# EAGLE schematic Raspberry_Pi_Circuit_Board (EAGLE 9.6.2)

## Sheet 1 of 15: Battery Charger
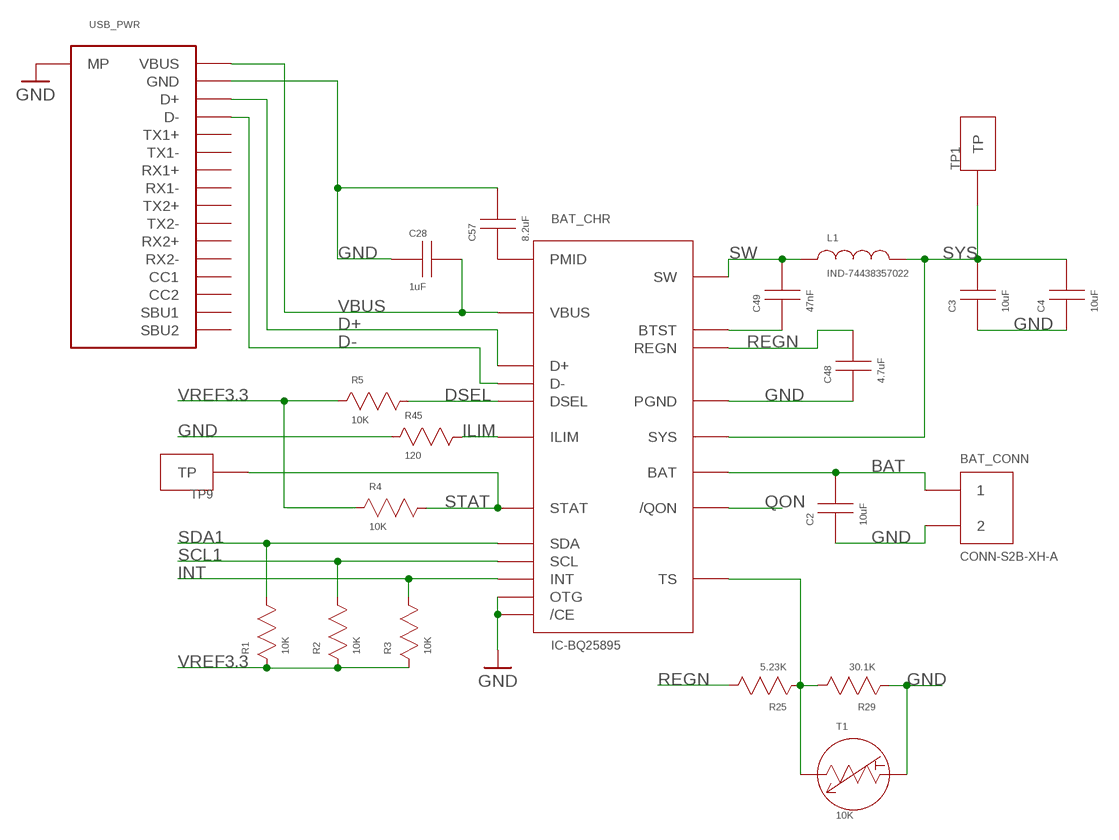
[diagram p0: schematic, sheet 1]

### Parts
BAT_CHR  IC-BQ25895  [IC-BQ25895]
BAT_CONN  CONN-S2B-XH-A  [CONN-S2B-XH-A]
C2  10uF  CAP-603  [CAP-603]
C3  10uF  CAP-603  [CAP-603]
C4  10uF  CAP-603  [CAP-603]
C28  1uF  CAP-603  [CAP-603]
C48  4.7uF  CAP-603  [CAP-603]
C49  47nF  CAP-603  [CAP-603]
C57  8.2uF  CAP-603  [CAP-603]
L1  IND-74438357022  [IND-74438357022]
R1  10K  RES-603  [RES-603]
R2  10K  RES-603  [RES-603]
R3  10K  RES-603  [RES-603]
R4  10K  RES-603  [RES-603]
R5  10K  RES-603  [RES-603]
R25  5.23K  RES-603  [RES-603]
R29  30.1K  RES-603  [RES-603]
R45  120  RES-603  [RES-603]
T1  10K  THERM-NTCLE101E3C90173  [THERM-NTCLE101E3C90173]
TP1  TESTPOINT  [TESTPOINT]
TP9  TESTPOINT  [TESTPOINT]
USB_PWR  USBC-USB-C31-S-RA-CS1D-BK-T/R  [USBC-USB-C31-S-RA-CS1D-BK-T/R]

### Nets
BAT: BAT_CHR.BAT1(BAT) BAT_CHR.BAT2(BAT) BAT_CONN.1 C2.C ; also sheet 8
D+: BAT_CHR.D+ USB_PWR.D+ USB_PWR.D+_2(D+)
D-: BAT_CHR.D- USB_PWR.D- USB_PWR.D-_2(D-)
DSEL: BAT_CHR.DSEL R5.C
GND: BAT_CHR./CE BAT_CHR.OTG BAT_CHR.PGND1(PGND) BAT_CHR.PGND2(PGND) BAT_CHR.PWRPAD(PGND) BAT_CONN.2 C2.A C3.A C4.A C28.A C48.A C57.C R29.A R45.A T1.2 USB_PWR.GND_1(GND) USB_PWR.GND_2(GND) USB_PWR.GND_3(GND) USB_PWR.GND_4(GND) USB_PWR.MP_1(MP) USB_PWR.MP_2(MP) USB_PWR.MP_3(MP) USB_PWR.MP_4(MP) ; also sheet 2,3,4,5,6,7,8,9,10,11,12,13,14,15
ILIM: BAT_CHR.ILIM R45.C
INT: BAT_CHR.INT R3.C
N$1: BAT_CHR.BTST C49.A
N$4: BAT_CHR.TS R25.A R29.C T1.1
N$11: BAT_CHR.PMID C57.A
QON: BAT_CHR./QON ; also sheet 8
REGN: BAT_CHR.REGN C48.C R25.C
SCL1: BAT_CHR.SCL R2.C ; also sheet 9,14
SDA1: BAT_CHR.SDA R1.C ; also sheet 9,14
STAT [PWR 1A]: BAT_CHR.STAT R4.C TP9.TP ; also sheet 8
SW: BAT_CHR.SW1(SW) BAT_CHR.SW2(SW) C49.C L1.A
SYS: BAT_CHR.SYS1(SYS) BAT_CHR.SYS2(SYS) C3.C C4.C L1.C TP1.TP ; also sheet 2,3
VBUS [PWR 1A]: BAT_CHR.VBUS C28.C USB_PWR.VBUS_1(VBUS) USB_PWR.VBUS_2(VBUS) USB_PWR.VBUS_3(VBUS) USB_PWR.VBUS_4(VBUS)
VREF3.3: R1.A R2.A R3.A R4.A R5.A ; also sheet 3,4,5,8,10,11,12,13,14,15
Unconnected: USB_PWR.CC1 USB_PWR.CC2 USB_PWR.RX1+ USB_PWR.RX1- USB_PWR.RX2+ USB_PWR.RX2- USB_PWR.SBU1 USB_PWR.SBU2 USB_PWR.TX1+ USB_PWR.TX1- USB_PWR.TX2+ USB_PWR.TX2-

## Sheet 2 of 15: 5V Regulator
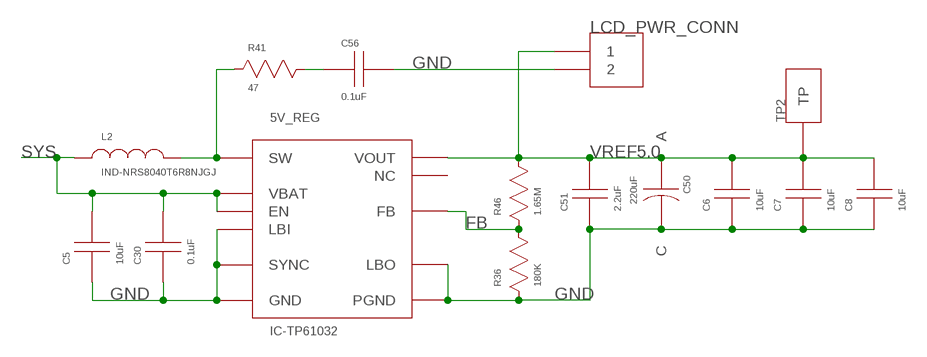
[diagram p1: schematic, sheet 2]

### Parts
5V_REG  IC-TP61032  [IC-TPS61032]
C5  10uF  CAP-603  [CAP-603]
C6  10uF  CAP-603  [CAP-603]
C7  10uF  CAP-603  [CAP-603]
C8  10uF  CAP-603  [CAP-603]
C30  0.1uF  CAP-603  [CAP-603]
C50  220uF  CAP-TAN-1411  [CAP-TAN-1411]
C51  2.2uF  CAP-603  [CAP-603]
C56  0.1uF  CAP-603  [CAP-603]
L2  IND-NRS8040T6R8NJGJ  [IND-NRS8040T6R8NJGJ]
LCD_PWR_CONN  CONN-282834-2  [CONN-282834-2]
R36  180K  RES-603  [RES-603]
R41  47  RES-603  [RES-603]
R46  1.65M  RES-603  [RES-603]
TP2  TESTPOINT  [TESTPOINT]

### Nets
FB: 5V_REG.FB R36.C R46.A
GND: 5V_REG.GND 5V_REG.LBI 5V_REG.LBO 5V_REG.PGND1(PGND) 5V_REG.PGND2(PGND) 5V_REG.PGND3(PGND) 5V_REG.PWRPAD(PGND) 5V_REG.SYNC C5.A C6.A C7.A C8.A C30.A C50.C C51.A C56.C LCD_PWR_CONN.2 R36.A ; also sheet 1,3,4,5,6,7,8,9,10,11,12,13,14,15
N$6: C56.A R41.C
SNUB: 5V_REG.SW1(SW) 5V_REG.SW2(SW) L2.C R41.A
SYS: 5V_REG.EN 5V_REG.VBAT C5.C C30.C L2.A ; also sheet 1,3
VREF5.0: 5V_REG.VOUT1(VOUT) 5V_REG.VOUT2(VOUT) 5V_REG.VOUT3(VOUT) C6.C C7.C C8.C C50.A C51.C LCD_PWR_CONN.1 R46.C TP2.TP ; also sheet 7,8,9,12
Unconnected: 5V_REG.NC

## Sheet 3 of 15: 3.3V/1.8V Regulator
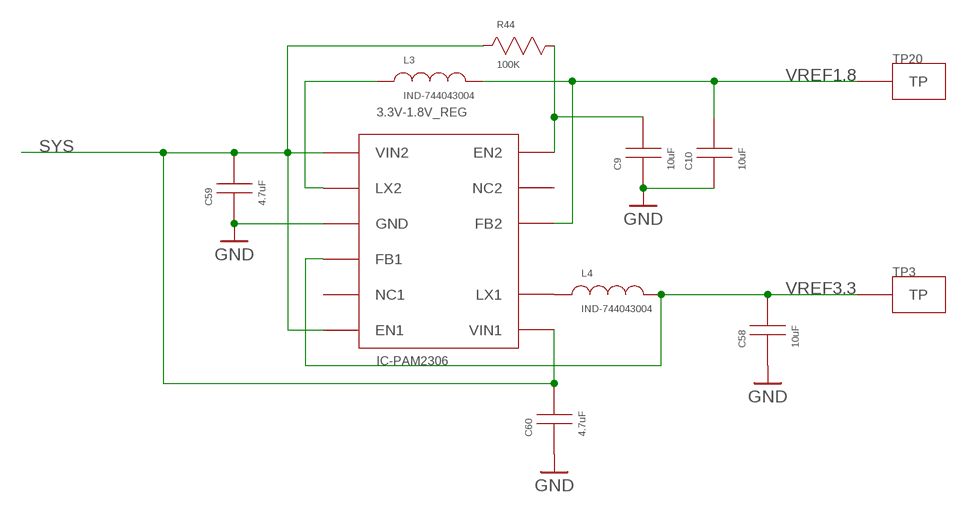
[diagram p2: schematic, sheet 3]

### Parts
3.3V-1.8V_REG  IC-PAM2306  [IC-PAM2306]
C9  10uF  CAP-603  [CAP-603]
C10  10uF  CAP-603  [CAP-603]
C58  10uF  CAP-603  [CAP-603]
C59  4.7uF  CAP-603  [CAP-603]
C60  4.7uF  CAP-603  [CAP-603]
L3  IND-744043004  [IND-744043004]
L4  IND-744043004  [IND-744043004]
R44  100K  RES-603  [RES-603]
TP3  TESTPOINT  [TESTPOINT]
TP20  TESTPOINT  [TESTPOINT]

### Nets
GND: 3.3V-1.8V_REG.GND1(GND) 3.3V-1.8V_REG.GND2(GND) 3.3V-1.8V_REG.PWRPAD(GND) C9.A C10.A C58.A C59.A C60.A ; also sheet 1,2,4,5,6,7,8,9,10,11,12,13,14,15
N$63: 3.3V-1.8V_REG.LX2 L3.A
N$66: 3.3V-1.8V_REG.EN2 C9.C R44.C
N$68: 3.3V-1.8V_REG.LX1 L4.A
SYS: 3.3V-1.8V_REG.EN1 3.3V-1.8V_REG.VIN1 3.3V-1.8V_REG.VIN2 C59.C C60.C R44.A ; also sheet 1,2
VREF1.8: 3.3V-1.8V_REG.FB2 C10.C L3.C TP20.TP ; also sheet 5,15
VREF3.3: 3.3V-1.8V_REG.FB1 C58.C L4.C TP3.TP ; also sheet 1,4,5,8,10,11,12,13,14,15
Unconnected: 3.3V-1.8V_REG.NC1 3.3V-1.8V_REG.NC2

## Sheet 4 of 15: Controller
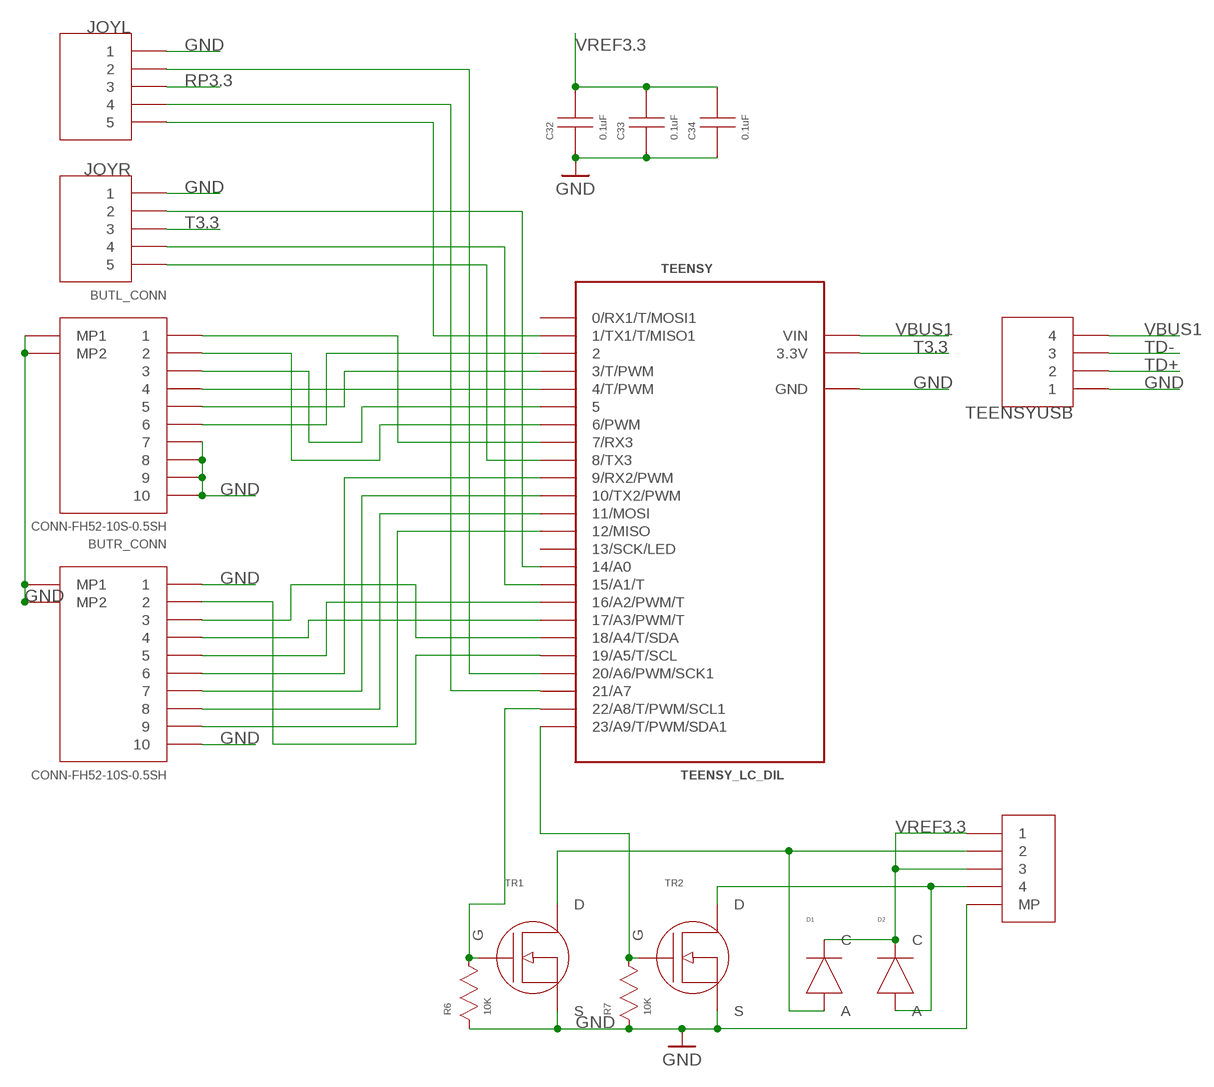
[diagram p3: schematic, sheet 4]

### Parts
BUTL_CONN  CONN-FH52-10S-0.5SH  [CONN-FH52-10S-0.5SH]
BUTR_CONN  CONN-FH52-10S-0.5SH  [CONN-FH52-10S-0.5SH]
C32  0.1uF  CAP-603  [CAP-603]
C33  0.1uF  CAP-603  [CAP-603]
C34  0.1uF  CAP-603  [CAP-603]
D1  DIODE-X3-WLB1608-2  [DIODE-X3-WLB1608-2]
D2  DIODE-X3-WLB1608-2  [DIODE-X3-WLB1608-2]
JOYL  CONN_5PIN  [CONN_5PIN]
JOYR  CONN_5PIN  [CONN_5PIN]
MOT_CONN  CONN-VS4B-ZR-SM4A-TF  [CONN-VS4B-ZR-SM4A-TF]
R6  10K  RES-603  [RES-603]
R7  10K  RES-603  [RES-603]
TEENSY  TEENSY_LC_DIL  [TEENSY_3.0-3.2&LC_DIL]
TEENSYUSB  CONN_4PIN  [CONN_4PIN]
TR1  TRAN-DMG2302UKQ  [TRAN-DMG2302UKQ]
TR2  TRAN-DMG2302UKQ  [TRAN-DMG2302UKQ]

### Nets
GND: BUTL_CONN.7 BUTL_CONN.8 BUTL_CONN.9 BUTL_CONN.10 BUTL_CONN.MP1 BUTL_CONN.MP2 BUTR_CONN.1 BUTR_CONN.10 BUTR_CONN.MP1 BUTR_CONN.MP2 C32.A C33.A C34.A JOYL.1 JOYR.1 MOT_CONN.MP_1(MP) MOT_CONN.MP_2(MP) R6.A R7.A TEENSY.AGND(GND) TEENSY.GND TEENSYUSB.1 TR1.S TR2.S ; also sheet 1,2,3,5,6,7,8,9,10,11,12,13,14,15
N$21: JOYR.2 TEENSY.14/A0
N$22: JOYR.4 TEENSY.15/A1(15/A1/T)
N$23: R6.C TEENSY.22/A8(22/A8/T/PWM/SCL1) TR1.G
N$24: R7.C TEENSY.23/A9(23/A9/T/PWM/SDA1) TR2.G
N$28: BUTR_CONN.8 TEENSY.11(11/MOSI)
N$29: D2.A MOT_CONN.4 TR2.D
N$30: D1.A MOT_CONN.2 TR1.D
N$31: BUTR_CONN.9 TEENSY.12(12/MISO)
N$32: BUTR_CONN.7 TEENSY.10(10/TX2/PWM)
N$33: BUTR_CONN.6 TEENSY.9(9/RX2/PWM)
N$34: JOYR.5 TEENSY.8(8/TX3)
N$35: BUTR_CONN.5 TEENSY.16/A2(16/A2/PWM/T)
N$36: BUTR_CONN.4 TEENSY.17/A3(17/A3/PWM/T)
N$37: BUTR_CONN.3 TEENSY.18/A4(18/A4/T/SDA)
N$38: BUTR_CONN.2 TEENSY.19/A5(19/A5/T/SCL)
N$39: JOYL.2 TEENSY.20/A6(20/A6/PWM/SCK1)
N$40: JOYL.4 TEENSY.21/A7
N$41: JOYL.5 TEENSY.1(1/TX1/T/MISO1)
N$42: BUTL_CONN.6 TEENSY.2
N$43: BUTL_CONN.5 TEENSY.3(3/T/PWM)
N$44: BUTL_CONN.4 TEENSY.4(4/T/PWM)
N$45: BUTL_CONN.3 TEENSY.5
N$46: BUTL_CONN.2 TEENSY.6(6/PWM)
N$47: BUTL_CONN.1 TEENSY.7(7/RX3)
RP3.3: JOYL.3 ; also sheet 6,9
T3.3: JOYR.3 TEENSY.3.3V
TD+: TEENSYUSB.2 ; also sheet 12
TD-: TEENSYUSB.3 ; also sheet 12
VBUS1: TEENSY.VIN TEENSYUSB.4 ; also sheet 11,12
VREF3.3: C32.C C33.C C34.C D1.C D2.C MOT_CONN.1 MOT_CONN.3 ; also sheet 1,3,5,8,10,11,12,13,14,15
Unconnected: TEENSY.0(0/RX1/T/MOSI1) TEENSY.13(13/SCK/LED)

## Sheet 5 of 15: Audio
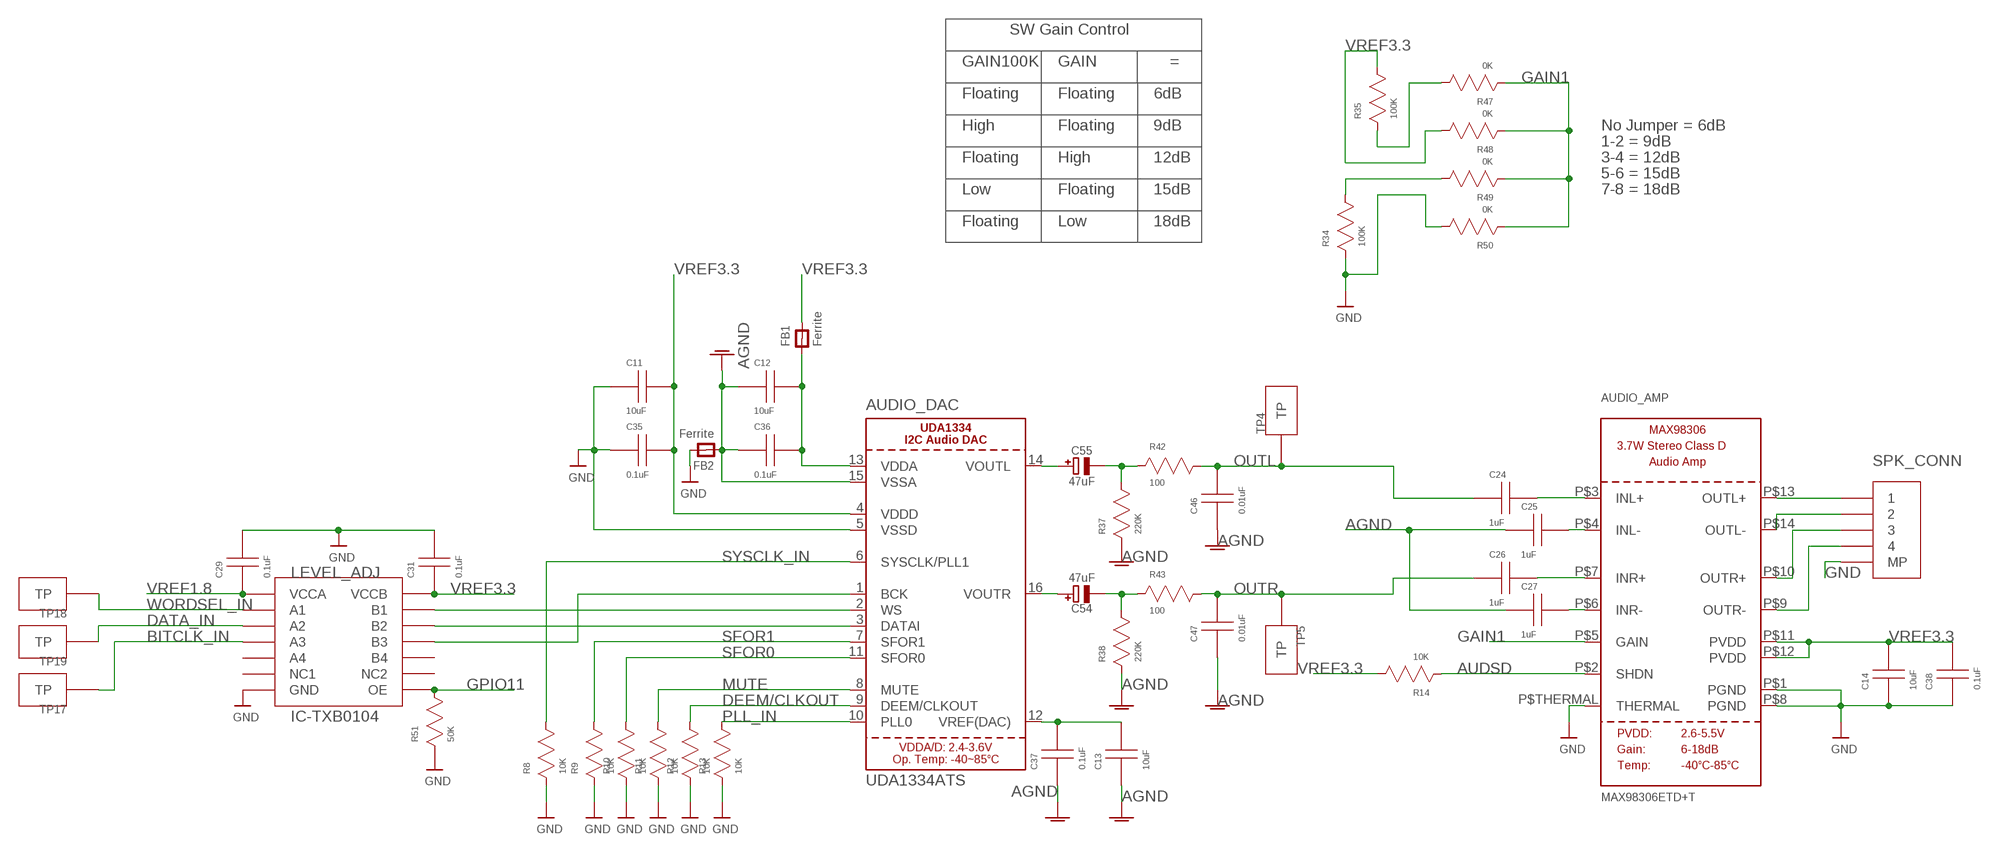
[diagram p4: schematic, sheet 5]

### Parts
AUDIO_AMP  MAX98306ETD+T  AUDIOAMP_MAX98306  [TDFN14_3X3MM]
AUDIO_DAC  UDA1334ATS  AUDIO_I2S_UDA1334""  [SSOP16_4.4MM]
C11  10uF  CAP-603  [CAP-603]
C12  10uF  CAP-603  [CAP-603]
C13  10uF  CAP-603  [CAP-603]
C14  10uF  CAP-603  [CAP-603]
C24  1uF  CAP-603  [CAP-603]
C25  1uF  CAP-603  [CAP-603]
C26  1uF  CAP-603  [CAP-603]
C27  1uF  CAP-603  [CAP-603]
C29  0.1uF  CAP-603  [CAP-603]
C31  0.1uF  CAP-603  [CAP-603]
C35  0.1uF  CAP-603  [CAP-603]
C36  0.1uF  CAP-603  [CAP-603]
C37  0.1uF  CAP-603  [CAP-603]
C38  0.1uF  CAP-603  [CAP-603]
C46  0.01uF  CAP-603  [CAP-603]
C47  0.01uF  CAP-603  [CAP-603]
C54  47uF  CAP_ELECTROLYTICPANASONIC_C  [PANASONIC_C]
C55  47uF  CAP_ELECTROLYTICPANASONIC_C  [PANASONIC_C]
FB1  Ferrite  FERRITE0805  [0805@1]
FB2  Ferrite  FERRITE0805  [0805@1]
LEVEL_ADJ  IC-TXB0104  [IC-TXB0104]
R8  10K  RES-603  [RES-603]
R9  10K  RES-603  [RES-603]
R10  10K  RES-603  [RES-603]
R11  10K  RES-603  [RES-603]
R12  10K  RES-603  [RES-603]
R13  10K  RES-603  [RES-603]
R14  10K  RES-603  [RES-603]
R34  100K  RES-603  [RES-603]
R35  100K  RES-603  [RES-603]
R37  220K  RES-603  [RES-603]
R38  220K  RES-603  [RES-603]
R42  100  RES-603  [RES-603]
R43  100  RES-603  [RES-603]
R47  0K  RES-603  [RES-603]
R48  0K  RES-603  [RES-603]
R49  0K  RES-603  [RES-603]
R50  0K  RES-603  [RES-603]
R51  50K  RES-603  [RES-603]
SPK_CONN  CONN-VS4B-ZR-SM4A-TF  [CONN-VS4B-ZR-SM4A-TF]
TP4  TESTPOINT  [TESTPOINT]
TP5  TESTPOINT  [TESTPOINT]
TP17  TESTPOINT  [TESTPOINT]
TP18  TESTPOINT  [TESTPOINT]
TP19  TESTPOINT  [TESTPOINT]

### Nets
AGND: AUDIO_DAC.15(VSSA) C12.A C13.A C25.A C27.A C36.A C37.A C46.A C47.A FB2.1 R37.A R38.A ; also sheet 11
AUDSD: AUDIO_AMP.P$2(SHDN) R14.A ; also sheet 11
BITCLK_IN: LEVEL_ADJ.A3 TP17.TP ; also sheet 9
DATA_IN: LEVEL_ADJ.A2 TP19.TP ; also sheet 9
DEEM/CLKOUT: AUDIO_DAC.9(DEEM/CLKOUT) R12.C
GAIN1: AUDIO_AMP.P$5(GAIN) R47.A R48.A R49.A R50.A
GND: AUDIO_AMP.P$1(PGND) AUDIO_AMP.P$8(PGND) AUDIO_AMP.P$THERMAL(THERMAL) AUDIO_DAC.5(VSSD) C11.A C14.A C29.C C31.C C35.A C38.A FB2.2 LEVEL_ADJ.GND R8.A R9.A R10.A R11.A R12.A R13.A R34.A R50.C R51.A SPK_CONN.MP_1(MP) SPK_CONN.MP_2(MP) ; also sheet 1,2,3,4,6,7,8,9,10,11,12,13,14,15
GPIO11: LEVEL_ADJ.OE R51.C ; also sheet 9
MUTE: AUDIO_DAC.8(MUTE) R11.C
N$3: AUDIO_DAC.13(VDDA) C12.C C36.C FB1.1
N$5: C54.- R38.C R43.A
N$7: C55.- R37.C R42.A
N$8: AUDIO_DAC.1(BCK) LEVEL_ADJ.B3
N$9: AUDIO_DAC.2(WS) LEVEL_ADJ.B1
N$10: AUDIO_DAC.12(VREF(DAC)) C13.C C37.C
N$12: AUDIO_DAC.16(VOUTR) C54.+
N$13: AUDIO_DAC.14(VOUTL) C55.+
N$14: R35.A R47.C
N$15: R34.C R49.C
N$16: AUDIO_AMP.P$3(INL+) C24.C
N$17: AUDIO_AMP.P$4(INL-) C25.C
N$18: AUDIO_AMP.P$7(INR+) C26.C
N$19: AUDIO_AMP.P$6(INR-) C27.C
N$20: AUDIO_AMP.P$13(OUTL+) SPK_CONN.1
N$25: AUDIO_AMP.P$14(OUTL-) SPK_CONN.2
N$26: AUDIO_AMP.P$10(OUTR+) SPK_CONN.3
N$27: AUDIO_AMP.P$9(OUTR-) SPK_CONN.4
N$67: AUDIO_DAC.3(DATAI) LEVEL_ADJ.B2
OUTL: C24.A C46.C R42.C TP4.TP ; also sheet 11
OUTR: C26.A C47.C R43.C TP5.TP ; also sheet 11
PLL_IN: AUDIO_DAC.10(PLL0) R13.C
SFOR0: AUDIO_DAC.11(SFOR0) R10.C
SFOR1: AUDIO_DAC.7(SFOR1) R9.C
SYSCLK_IN: AUDIO_DAC.6(SYSCLK/PLL1) R8.C
VREF1.8: C29.A LEVEL_ADJ.VCCA ; also sheet 3,15
VREF3.3: AUDIO_AMP.P$11(PVDD) AUDIO_AMP.P$12(PVDD) AUDIO_DAC.4(VDDD) C11.C C14.C C31.A C35.C C38.C FB1.2 LEVEL_ADJ.VCCB R14.C R35.C R48.C ; also sheet 1,3,4,8,10,11,12,13,14,15
WORDSEL_IN: LEVEL_ADJ.A1 TP18.TP ; also sheet 9
Unconnected: LEVEL_ADJ.A4 LEVEL_ADJ.B4 LEVEL_ADJ.NC1 LEVEL_ADJ.NC2

### Notes on the sheet
- SW Gain Control
- GAIN100K | GAIN | =
- Floating | Floating | 6dB
- High | Floating | 9dB | No Jumper = 6dB
- 1-2 = 9dB
- Floating | High | 12dB | 3-4 = 12dB
- 5-6 = 15dB
- Low | Floating | 15dB | 7-8 = 18dB
- Floating | Low | 18dB

## Sheet 6 of 15: MicroSD
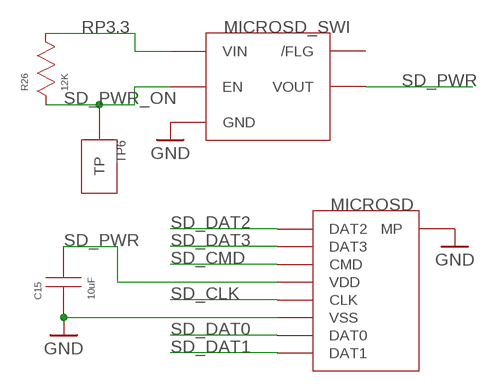
[diagram p5: schematic, sheet 6]

### Parts
C15  10uF  CAP-603  [CAP-603]
MICROSD  MICROSD-5033981892_SD  [MICROSD-5033981892_SD]
MICROSD_SWI  IC-RT9742  [IC-RT9742]
R26  12K  RES-603  [RES-603]
TP6  TESTPOINT  [TESTPOINT]

### Nets
GND: C15.A MICROSD.DL(MP) MICROSD.DS(MP) MICROSD.MP_1(MP) MICROSD.MP_2(MP) MICROSD.MP_3(MP) MICROSD.MP_4(MP) MICROSD.VSS MICROSD_SWI.GND ; also sheet 1,2,3,4,5,7,8,9,10,11,12,13,14,15
RP3.3: MICROSD_SWI.VIN R26.C ; also sheet 4,9
SD_CLK: MICROSD.CLK ; also sheet 9
SD_CMD: MICROSD.CMD ; also sheet 9
SD_DAT0: MICROSD.DAT0 ; also sheet 9
SD_DAT1: MICROSD.DAT1 ; also sheet 9
SD_DAT2: MICROSD.DAT2 ; also sheet 9
SD_DAT3: MICROSD.DAT3 ; also sheet 9
SD_PWR: C15.C MICROSD.VDD MICROSD_SWI.VOUT
SD_PWR_ON: MICROSD_SWI.EN R26.A TP6.TP ; also sheet 9
Unconnected: MICROSD_SWI./FLG

## Sheet 7 of 15: HDMI
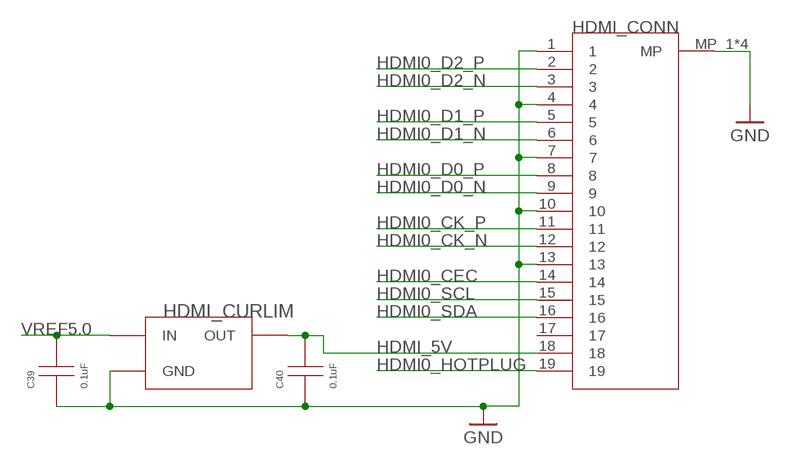
[diagram p6: schematic, sheet 7]

### Parts
C39  0.1uF  CAP-603  [CAP-603]
C40  0.1uF  CAP-603  [CAP-603]
HDMI_CONN  HDMI-2001-1-2-21-00-BK  [HDMI-2001-1-2-21-00-BK]
HDMI_CURLIM  CURLIM-AP2331  [CURLIM-AP2331]

### Nets
GND: C39.A C40.A HDMI_CONN.1 HDMI_CONN.4 HDMI_CONN.7 HDMI_CONN.10 HDMI_CONN.13 HDMI_CONN.MP_1(MP) HDMI_CONN.MP_2(MP) HDMI_CONN.MP_3(MP) HDMI_CONN.MP_4(MP) HDMI_CURLIM.GND ; also sheet 1,2,3,4,5,6,8,9,10,11,12,13,14,15
HDMI0_CEC: HDMI_CONN.14 ; also sheet 9
HDMI0_CK_N: HDMI_CONN.12 ; also sheet 9
HDMI0_CK_P: HDMI_CONN.11 ; also sheet 9
HDMI0_D0_N: HDMI_CONN.9 ; also sheet 9
HDMI0_D0_P: HDMI_CONN.8 ; also sheet 9
HDMI0_D1_N: HDMI_CONN.6 ; also sheet 9
HDMI0_D1_P: HDMI_CONN.5 ; also sheet 9
HDMI0_D2_N: HDMI_CONN.3 ; also sheet 9
HDMI0_D2_P: HDMI_CONN.2 ; also sheet 9
HDMI0_HOTPLUG: HDMI_CONN.19 ; also sheet 9
HDMI0_SCL: HDMI_CONN.15 ; also sheet 9
HDMI0_SDA: HDMI_CONN.16 ; also sheet 9
HDMI_5V: C40.C HDMI_CONN.18 HDMI_CURLIM.OUT
VREF5.0: C39.C HDMI_CURLIM.IN ; also sheet 2,8,9,12
Unconnected: HDMI_CONN.17

## Sheet 8 of 15: Buttons/LEDs
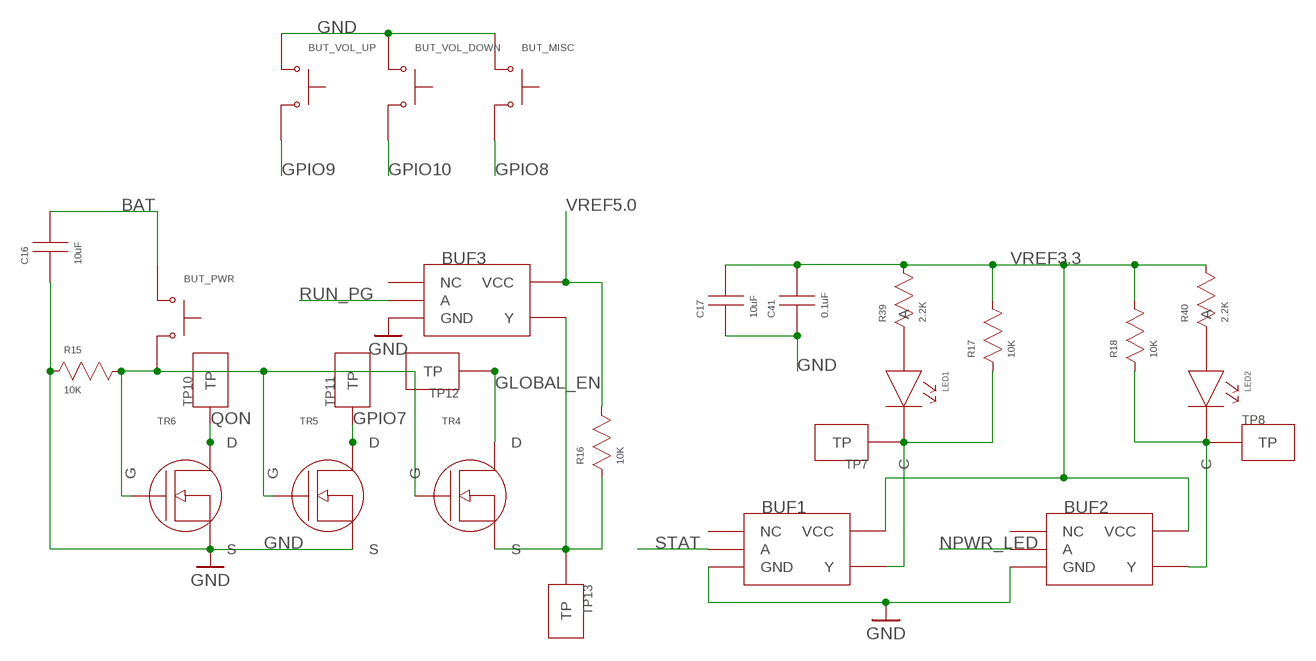
[diagram p7: schematic, sheet 8]

### Parts
BUF1  BUF-74LVC1G07  [BUF-74LVC1G07]
BUF2  BUF-74LVC1G07  [BUF-74LVC1G07]
BUF3  BUF-74LVC1G07  [BUF-74LVC1G07]
BUT_MISC  BUT-KSS331GLFS  [BUT-KSS331GLFS]
BUT_PWR  BUT-KSS331GLFS  [BUT-KSS331GLFS]
BUT_VOL_DOWN  BUT-KSS331GLFS  [BUT-KSS331GLFS]
BUT_VOL_UP  BUT-KSS331GLFS  [BUT-KSS331GLFS]
C16  10uF  CAP-603  [CAP-603]
C17  10uF  CAP-603  [CAP-603]
C41  0.1uF  CAP-603  [CAP-603]
LED1  LED-SM0805UWC  [LED-SM0805UWC]
LED2  LED-SM0805UWC  [LED-SM0805UWC]
R15  10K  RES-603  [RES-603]
R16  10K  RES-603  [RES-603]
R17  10K  RES-603  [RES-603]
R18  10K  RES-603  [RES-603]
R39  2.2K  RES-603  [RES-603]
R40  2.2K  RES-603  [RES-603]
TP7  TESTPOINT  [TESTPOINT]
TP8  TESTPOINT  [TESTPOINT]
TP10  TESTPOINT  [TESTPOINT]
TP11  TESTPOINT  [TESTPOINT]
TP12  TESTPOINT  [TESTPOINT]
TP13  TESTPOINT  [TESTPOINT]
TR4  TRAN-DMG2302UKQ  [TRAN-DMG2302UKQ]
TR5  TRAN-DMG2302UKQ  [TRAN-DMG2302UKQ]
TR6  TRAN-DMG2302UKQ  [TRAN-DMG2302UKQ]

### Nets
BAT: BUT_PWR.1 C16.C ; also sheet 1
GLOBAL_EN: TP12.TP TR4.D ; also sheet 9
GND: BUF1.GND BUF2.GND BUF3.GND BUT_MISC.1 BUT_VOL_DOWN.1 BUT_VOL_UP.1 C16.A C17.A C41.A R15.A TR5.S TR6.S ; also sheet 1,2,3,4,5,6,7,9,10,11,12,13,14,15
GPIO7: TP11.TP TR5.D ; also sheet 9
GPIO8: BUT_MISC.2 ; also sheet 9
GPIO9: BUT_VOL_UP.2 ; also sheet 9
GPIO10: BUT_VOL_DOWN.2 ; also sheet 9
N$2: BUF1.Y LED1.C R17.A TP7.TP
N$48: BUT_PWR.2 R15.C TR4.G TR5.G TR6.G
N$49: LED1.A R39.A
N$50: LED2.A R40.A
N$51: BUF2.Y LED2.C R18.A TP8.TP
N$53: BUF3.Y R16.A TP13.TP TR4.S
NPWR_LED: BUF2.A ; also sheet 9
QON: TP10.TP TR6.D ; also sheet 1
RUN_PG: BUF3.A ; also sheet 9
STAT [PWR 1A]: BUF1.A ; also sheet 1
VREF3.3: BUF1.VCC BUF2.VCC C17.C C41.C R17.C R18.C R39.C R40.C ; also sheet 1,3,4,5,10,11,12,13,14,15
VREF5.0: BUF3.VCC R16.C ; also sheet 2,7,9,12
Unconnected: BUF1.NC BUF2.NC BUF3.NC

## Sheet 9 of 15: Raspberry Pi
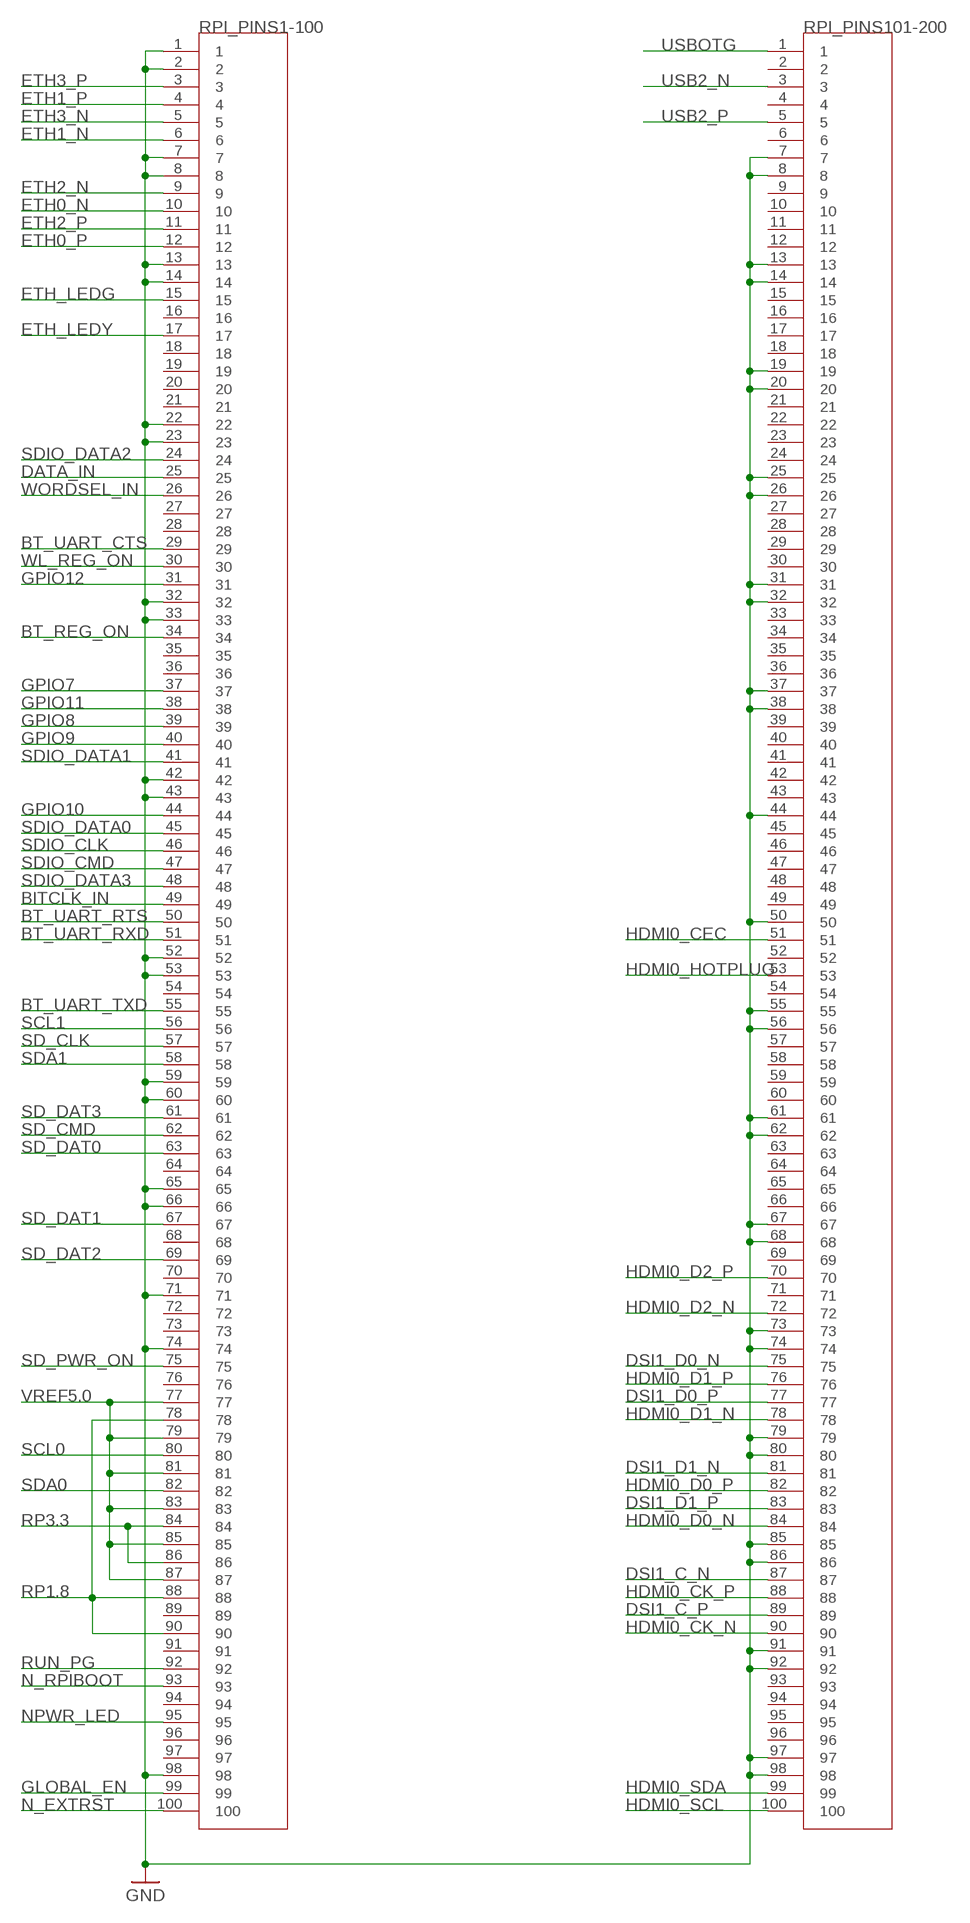
[diagram p8: schematic, sheet 9]

### Parts
RPI_PINS1-100  CONN-DF40_CL0594-5437-8-00_2D  [CONN-DF40_CL0594-5437-8-00_2D]
RPI_PINS101-200  CONN-DF40_CL0594-5437-8-00_2D  [CONN-DF40_CL0594-5437-8-00_2D]

### Nets
BITCLK_IN: RPI_PINS1-100.49 ; also sheet 5
BT_REG_ON: RPI_PINS1-100.34 ; also sheet 15
BT_UART_CTS: RPI_PINS1-100.29 ; also sheet 15
BT_UART_RTS: RPI_PINS1-100.50 ; also sheet 15
BT_UART_RXD: RPI_PINS1-100.51 ; also sheet 15
BT_UART_TXD: RPI_PINS1-100.55 ; also sheet 15
DATA_IN: RPI_PINS1-100.25 ; also sheet 5
DSI1_C_N: RPI_PINS101-200.87 ; also sheet 10
DSI1_C_P: RPI_PINS101-200.89 ; also sheet 10
DSI1_D0_N: RPI_PINS101-200.75 ; also sheet 10
DSI1_D0_P: RPI_PINS101-200.77 ; also sheet 10
DSI1_D1_N: RPI_PINS101-200.81 ; also sheet 10
DSI1_D1_P: RPI_PINS101-200.83 ; also sheet 10
ETH0_N: RPI_PINS1-100.10 ; also sheet 11
ETH0_P: RPI_PINS1-100.12 ; also sheet 11
ETH1_N: RPI_PINS1-100.6 ; also sheet 11
ETH1_P: RPI_PINS1-100.4 ; also sheet 11
ETH2_N: RPI_PINS1-100.9 ; also sheet 11
ETH2_P: RPI_PINS1-100.11 ; also sheet 11
ETH3_N: RPI_PINS1-100.5 ; also sheet 11
ETH3_P: RPI_PINS1-100.3 ; also sheet 11
ETH_LEDG: RPI_PINS1-100.15 ; also sheet 11
ETH_LEDY: RPI_PINS1-100.17 ; also sheet 11
GLOBAL_EN: RPI_PINS1-100.99 ; also sheet 8
GND: RPI_PINS1-100.1 RPI_PINS1-100.2 RPI_PINS1-100.7 RPI_PINS1-100.8 RPI_PINS1-100.13 RPI_PINS1-100.14 RPI_PINS1-100.22 RPI_PINS1-100.23 RPI_PINS1-100.32 RPI_PINS1-100.33 RPI_PINS1-100.42 RPI_PINS1-100.43 RPI_PINS1-100.52 RPI_PINS1-100.53 RPI_PINS1-100.59 RPI_PINS1-100.60 RPI_PINS1-100.65 RPI_PINS1-100.66 RPI_PINS1-100.71 RPI_PINS1-100.74 RPI_PINS1-100.98 RPI_PINS101-200.7 RPI_PINS101-200.8 RPI_PINS101-200.13 RPI_PINS101-200.14 RPI_PINS101-200.19 RPI_PINS101-200.20 RPI_PINS101-200.25 RPI_PINS101-200.26 RPI_PINS101-200.31 RPI_PINS101-200.32 RPI_PINS101-200.37 RPI_PINS101-200.38 RPI_PINS101-200.44 RPI_PINS101-200.50 RPI_PINS101-200.55 RPI_PINS101-200.56 RPI_PINS101-200.61 RPI_PINS101-200.62 RPI_PINS101-200.67 RPI_PINS101-200.68 RPI_PINS101-200.73 RPI_PINS101-200.74 RPI_PINS101-200.79 RPI_PINS101-200.80 RPI_PINS101-200.85 RPI_PINS101-200.86 RPI_PINS101-200.91 RPI_PINS101-200.92 RPI_PINS101-200.97 RPI_PINS101-200.98 ; also sheet 1,2,3,4,5,6,7,8,10,11,12,13,14,15
GPIO7: RPI_PINS1-100.37 ; also sheet 8
GPIO8: RPI_PINS1-100.39 ; also sheet 8
GPIO9: RPI_PINS1-100.40 ; also sheet 8
GPIO10: RPI_PINS1-100.44 ; also sheet 8
GPIO11: RPI_PINS1-100.38 ; also sheet 5
GPIO12: RPI_PINS1-100.31 ; also sheet 13
HDMI0_CEC: RPI_PINS101-200.51 ; also sheet 7
HDMI0_CK_N: RPI_PINS101-200.90 ; also sheet 7
HDMI0_CK_P: RPI_PINS101-200.88 ; also sheet 7
HDMI0_D0_N: RPI_PINS101-200.84 ; also sheet 7
HDMI0_D0_P: RPI_PINS101-200.82 ; also sheet 7
HDMI0_D1_N: RPI_PINS101-200.78 ; also sheet 7
HDMI0_D1_P: RPI_PINS101-200.76 ; also sheet 7
HDMI0_D2_N: RPI_PINS101-200.72 ; also sheet 7
HDMI0_D2_P: RPI_PINS101-200.70 ; also sheet 7
HDMI0_HOTPLUG: RPI_PINS101-200.53 ; also sheet 7
HDMI0_SCL: RPI_PINS101-200.100 ; also sheet 7
HDMI0_SDA: RPI_PINS101-200.99 ; also sheet 7
N_EXTRST: RPI_PINS1-100.100 ; also sheet 12
N_RPIBOOT: RPI_PINS1-100.93 ; also sheet 12
NPWR_LED: RPI_PINS1-100.95 ; also sheet 8
RP1.8: RPI_PINS1-100.78 RPI_PINS1-100.88 RPI_PINS1-100.90
RP3.3: RPI_PINS1-100.84 RPI_PINS1-100.86 ; also sheet 4,6
RUN_PG: RPI_PINS1-100.92 ; also sheet 8
SCL0: RPI_PINS1-100.80 ; also sheet 10
SCL1: RPI_PINS1-100.56 ; also sheet 1,14
SD_CLK: RPI_PINS1-100.57 ; also sheet 6
SD_CMD: RPI_PINS1-100.62 ; also sheet 6
SD_DAT0: RPI_PINS1-100.63 ; also sheet 6
SD_DAT1: RPI_PINS1-100.67 ; also sheet 6
SD_DAT2: RPI_PINS1-100.69 ; also sheet 6
SD_DAT3: RPI_PINS1-100.61 ; also sheet 6
SD_PWR_ON: RPI_PINS1-100.75 ; also sheet 6
SDA0: RPI_PINS1-100.82 ; also sheet 10
SDA1: RPI_PINS1-100.58 ; also sheet 1,14
SDIO_CLK: RPI_PINS1-100.46 ; also sheet 15
SDIO_CMD: RPI_PINS1-100.47 ; also sheet 15
SDIO_DATA0: RPI_PINS1-100.45 ; also sheet 15
SDIO_DATA1: RPI_PINS1-100.41 ; also sheet 15
SDIO_DATA2: RPI_PINS1-100.24 ; also sheet 15
SDIO_DATA3: RPI_PINS1-100.48 ; also sheet 15
USB2_N: RPI_PINS101-200.3 ; also sheet 12
USB2_P: RPI_PINS101-200.5 ; also sheet 12
USBOTG: RPI_PINS101-200.1 ; also sheet 12
VREF5.0: RPI_PINS1-100.77 RPI_PINS1-100.79 RPI_PINS1-100.81 RPI_PINS1-100.83 RPI_PINS1-100.85 RPI_PINS1-100.87 ; also sheet 2,7,8,12
WL_REG_ON: RPI_PINS1-100.30 ; also sheet 15
WORDSEL_IN: RPI_PINS1-100.26 ; also sheet 5
Unconnected: RPI_PINS1-100.16 RPI_PINS1-100.18 RPI_PINS1-100.19 RPI_PINS1-100.20 RPI_PINS1-100.21 RPI_PINS1-100.27 RPI_PINS1-100.28 RPI_PINS1-100.35 RPI_PINS1-100.36 RPI_PINS1-100.54 RPI_PINS1-100.64 RPI_PINS1-100.68 RPI_PINS1-100.70 RPI_PINS1-100.72 RPI_PINS1-100.73 RPI_PINS1-100.76 RPI_PINS1-100.89 RPI_PINS1-100.91 RPI_PINS1-100.94 RPI_PINS1-100.96 RPI_PINS1-100.97 RPI_PINS101-200.2 RPI_PINS101-200.4 RPI_PINS101-200.6 RPI_PINS101-200.9 RPI_PINS101-200.10 RPI_PINS101-200.11 RPI_PINS101-200.12 RPI_PINS101-200.15 RPI_PINS101-200.16 RPI_PINS101-200.17 RPI_PINS101-200.18 RPI_PINS101-200.21 RPI_PINS101-200.22 RPI_PINS101-200.23 RPI_PINS101-200.24 RPI_PINS101-200.27 RPI_PINS101-200.28 RPI_PINS101-200.29 RPI_PINS101-200.30 RPI_PINS101-200.33 RPI_PINS101-200.34 RPI_PINS101-200.35 RPI_PINS101-200.36 RPI_PINS101-200.39 RPI_PINS101-200.40 RPI_PINS101-200.41 RPI_PINS101-200.42 RPI_PINS101-200.43 RPI_PINS101-200.45 RPI_PINS101-200.46 RPI_PINS101-200.47 RPI_PINS101-200.48 RPI_PINS101-200.49 RPI_PINS101-200.52 RPI_PINS101-200.54 RPI_PINS101-200.57 RPI_PINS101-200.58 RPI_PINS101-200.59 RPI_PINS101-200.60 RPI_PINS101-200.63 RPI_PINS101-200.64 RPI_PINS101-200.65 RPI_PINS101-200.66 RPI_PINS101-200.69 RPI_PINS101-200.71 RPI_PINS101-200.93 RPI_PINS101-200.94 RPI_PINS101-200.95 RPI_PINS101-200.96

## Sheet 10 of 15: Screen Connector
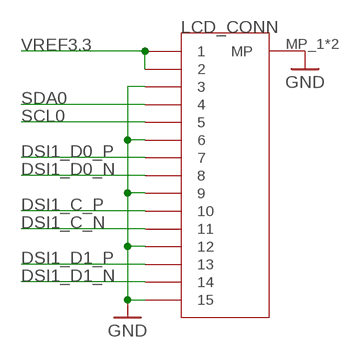
[diagram p9: schematic, sheet 10]

### Parts
LCD_CONN  FPC-1-84952-5  [FPC-1-84952-5]

### Nets
DSI1_C_N: LCD_CONN.11 ; also sheet 9
DSI1_C_P: LCD_CONN.10 ; also sheet 9
DSI1_D0_N: LCD_CONN.8 ; also sheet 9
DSI1_D0_P: LCD_CONN.7 ; also sheet 9
DSI1_D1_N: LCD_CONN.14 ; also sheet 9
DSI1_D1_P: LCD_CONN.13 ; also sheet 9
GND: LCD_CONN.3 LCD_CONN.6 LCD_CONN.9 LCD_CONN.12 LCD_CONN.15 LCD_CONN.MP_1(MP) LCD_CONN.MP_2(MP) ; also sheet 1,2,3,4,5,6,7,8,9,11,12,13,14,15
SCL0: LCD_CONN.5 ; also sheet 9
SDA0: LCD_CONN.4 ; also sheet 9
VREF3.3: LCD_CONN.1 LCD_CONN.2 ; also sheet 1,3,4,5,8,11,12,13,14,15

## Sheet 11 of 15: Board Connector
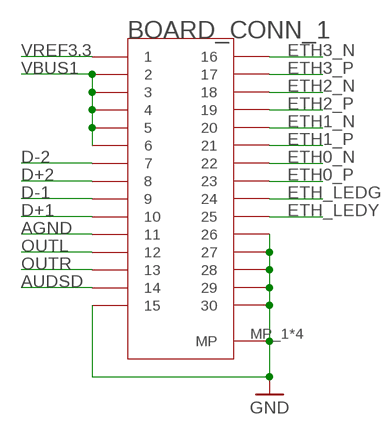
[diagram p10: schematic, sheet 11]

### Parts
BOARD_CONN_1  MEZZANINE-AXT630124  [MEZZANINE-AXT630124]

### Nets
AGND: BOARD_CONN_1.11 ; also sheet 5
AUDSD: BOARD_CONN_1.14 ; also sheet 5
D+1: BOARD_CONN_1.10 ; also sheet 12
D+2: BOARD_CONN_1.8 ; also sheet 12
D-1: BOARD_CONN_1.9 ; also sheet 12
D-2: BOARD_CONN_1.7 ; also sheet 12
ETH0_N: BOARD_CONN_1.22 ; also sheet 9
ETH0_P: BOARD_CONN_1.23 ; also sheet 9
ETH1_N: BOARD_CONN_1.20 ; also sheet 9
ETH1_P: BOARD_CONN_1.21 ; also sheet 9
ETH2_N: BOARD_CONN_1.18 ; also sheet 9
ETH2_P: BOARD_CONN_1.19 ; also sheet 9
ETH3_N: BOARD_CONN_1.16 ; also sheet 9
ETH3_P: BOARD_CONN_1.17 ; also sheet 9
ETH_LEDG: BOARD_CONN_1.24 ; also sheet 9
ETH_LEDY: BOARD_CONN_1.25 ; also sheet 9
GND: BOARD_CONN_1.15 BOARD_CONN_1.26 BOARD_CONN_1.27 BOARD_CONN_1.28 BOARD_CONN_1.29 BOARD_CONN_1.30 BOARD_CONN_1.MP_1(MP) BOARD_CONN_1.MP_2(MP) BOARD_CONN_1.MP_3(MP) BOARD_CONN_1.MP_4(MP) ; also sheet 1,2,3,4,5,6,7,8,9,10,12,13,14,15
OUTL: BOARD_CONN_1.12 ; also sheet 5
OUTR: BOARD_CONN_1.13 ; also sheet 5
VBUS1: BOARD_CONN_1.2 BOARD_CONN_1.3 BOARD_CONN_1.4 BOARD_CONN_1.5 BOARD_CONN_1.6 ; also sheet 4,12
VREF3.3: BOARD_CONN_1.1 ; also sheet 1,3,4,5,8,10,12,13,14,15

## Sheet 12 of 15: USB
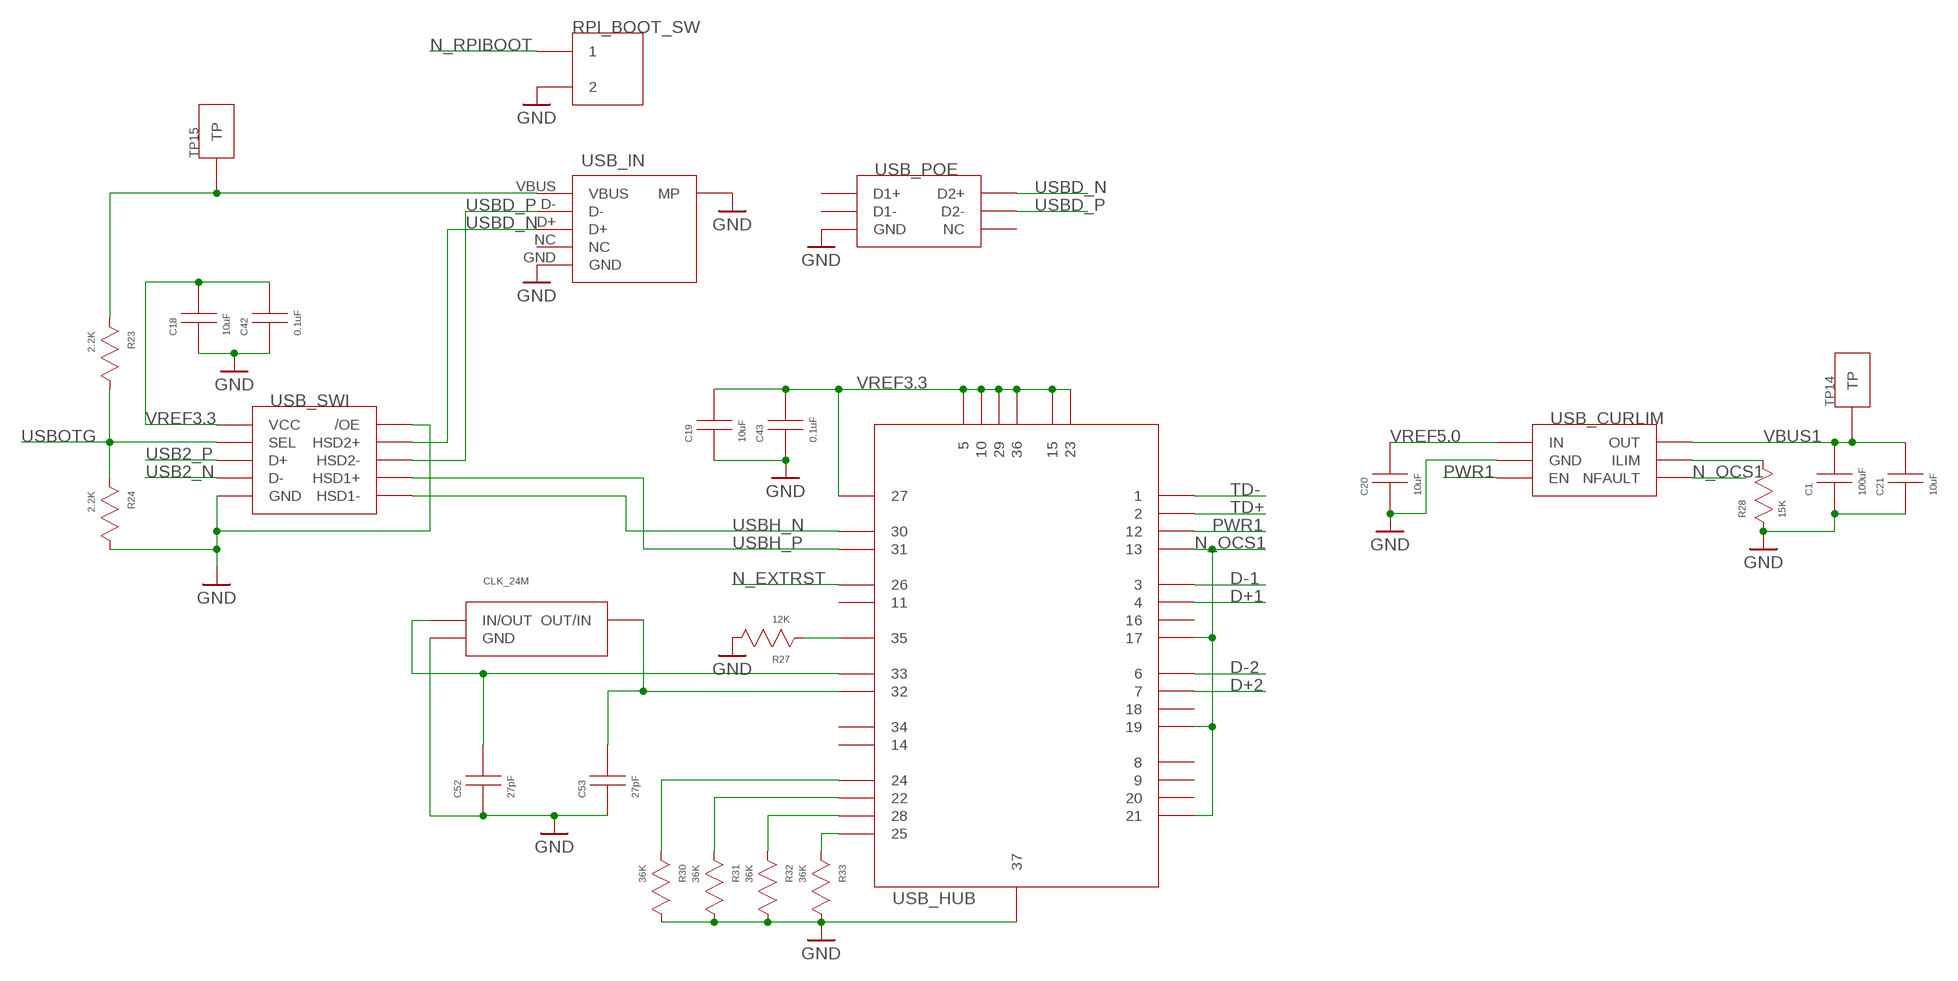
[diagram p11: schematic, sheet 12]

### Parts
C1  100uF  CAP-603  [CAP-603]
C18  10uF  CAP-603  [CAP-603]
C19  10uF  CAP-603  [CAP-603]
C20  10uF  CAP-603  [CAP-603]
C21  10uF  CAP-603  [CAP-603]
C42  0.1uF  CAP-603  [CAP-603]
C43  0.1uF  CAP-603  [CAP-603]
C52  27pF  CAP-603  [CAP-603]
C53  27pF  CAP-603  [CAP-603]
CLK_24M  CLK-ECS-240  [CLK-ECS-240]
R23  2.2K  RES-603  [RES-603]
R24  2.2K  RES-603  [RES-603]
R27  12K  RES-603  [RES-603]
R28  15K  RES-603  [RES-603]
R30  36K  RES-603  [RES-603]
R31  36K  RES-603  [RES-603]
R32  36K  RES-603  [RES-603]
R33  36K  RES-603  [RES-603]
RPI_BOOT_SW  DIP-A6TN-1104  [DIP-A6TN-1104]
TP14  TESTPOINT  [TESTPOINT]
TP15  TESTPOINT  [TESTPOINT]
USB_CURLIM  CURLIM-AP22653W6  [CURLIM-AP22653W6]
USB_HUB  USBPORT-USB2514BT-I/M2  [USBPORT-USB2514BT-I/M2]
USB_IN  USB-USB3131-30-0230-A  [USB-USB3131-30-0230-A]
USB_POE  POE_PROT-TPD4EUSB30DQAR  [POE_PROT-TPD4EUSB30DQAR]
USB_SWI  USB_SWITCH-FSUSB42-D  [USB_SWITCH-FSUSB42-D]

### Nets
D+1: USB_HUB.4 ; also sheet 11
D+2: USB_HUB.7 ; also sheet 11
D-1: USB_HUB.3 ; also sheet 11
D-2: USB_HUB.6 ; also sheet 11
GND: C1.A C18.A C19.A C20.A C21.A C42.A C43.A C52.A C53.A CLK_24M.GND_1(GND) CLK_24M.GND_2(GND) R24.C R27.C R28.A R30.C R31.C R32.C R33.C RPI_BOOT_SW.2 USB_CURLIM.GND USB_HUB.37 USB_IN.GND USB_IN.MP_1(MP) USB_IN.MP_2(MP) USB_POE.GND_1(GND) USB_POE.GND_2(GND) USB_SWI./OE USB_SWI.GND ; also sheet 1,2,3,4,5,6,7,8,9,10,11,13,14,15
N$56: R32.A USB_HUB.28
N$57: R28.C USB_CURLIM.ILIM
N$58: R31.A USB_HUB.22
N$59: R30.A USB_HUB.24
N$60: R23.A TP15.TP USB_IN.VBUS
N$61: C53.C CLK_24M.OUT/IN USB_HUB.32
N$62: C52.C CLK_24M.IN/OUT USB_HUB.33
N$64: R33.A USB_HUB.25
N$65: R27.A USB_HUB.35
N_EXTRST: USB_HUB.26 ; also sheet 9
N_OCS1: USB_CURLIM.NFAULT USB_HUB.13 USB_HUB.17 USB_HUB.19 USB_HUB.21
N_RPIBOOT: RPI_BOOT_SW.1 ; also sheet 9
PWR1: USB_CURLIM.EN USB_HUB.12
TD+: USB_HUB.2 ; also sheet 4
TD-: USB_HUB.1 ; also sheet 4
USB2_N: USB_SWI.D- ; also sheet 9
USB2_P: USB_SWI.D+ ; also sheet 9
USBD_N: USB_IN.D+ USB_POE.D2+ USB_SWI.HSD2+
USBD_P: USB_IN.D- USB_POE.D2- USB_SWI.HSD2-
USBH_N: USB_HUB.30 USB_SWI.HSD1-
USBH_P: USB_HUB.31 USB_SWI.HSD1+
USBOTG: R23.C R24.A USB_SWI.SEL ; also sheet 9
VBUS1: C1.C C21.C TP14.TP USB_CURLIM.OUT ; also sheet 4,11
VREF3.3: C18.C C19.C C42.C C43.C USB_HUB.5 USB_HUB.10 USB_HUB.15 USB_HUB.23 USB_HUB.27 USB_HUB.29 USB_HUB.36 USB_SWI.VCC ; also sheet 1,3,4,5,8,10,11,13,14,15
VREF5.0: C20.C USB_CURLIM.IN ; also sheet 2,7,8,9
Unconnected: USB_HUB.8 USB_HUB.9 USB_HUB.11 USB_HUB.14 USB_HUB.16 USB_HUB.18 USB_HUB.20 USB_HUB.34 USB_IN.NC USB_POE.D1+ USB_POE.D1- USB_POE.NC_1(NC) USB_POE.NC_2(NC) USB_POE.NC_3(NC) USB_POE.NC_4(NC)

## Sheet 13 of 15: FAN
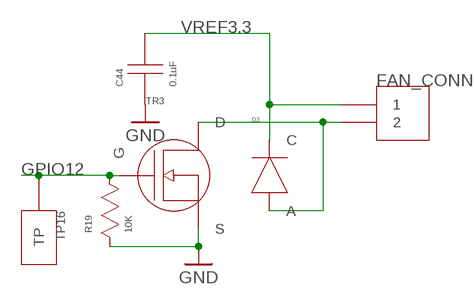
[diagram p12: schematic, sheet 13]

### Parts
C44  0.1uF  CAP-603  [CAP-603]
D3  DIODE-X3-WLB1608-2  [DIODE-X3-WLB1608-2]
FAN_CONN  CONN-282834-2  [CONN-282834-2]
R19  10K  RES-603  [RES-603]
TP16  TESTPOINT  [TESTPOINT]
TR3  TRAN-DMG2302UKQ  [TRAN-DMG2302UKQ]

### Nets
GND: C44.A R19.A TR3.S ; also sheet 1,2,3,4,5,6,7,8,9,10,11,12,14,15
GPIO12: R19.C TP16.TP TR3.G ; also sheet 9
N$55: D3.A FAN_CONN.2 TR3.D
VREF3.3: C44.C D3.C FAN_CONN.1 ; also sheet 1,3,4,5,8,10,11,12,14,15

## Sheet 14 of 15: Accelerometer
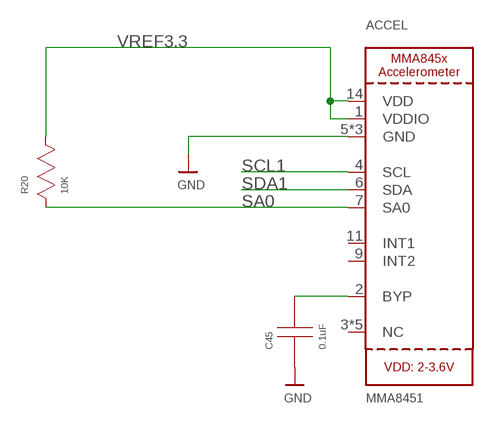
[diagram p13: schematic, sheet 14]

### Parts
ACCEL  MMA8451  ACCEL_MMA845X  [MMA845X_QFN_16MM]
C45  0.1uF  CAP-603  [CAP-603]
R20  10K  RES-603  [RES-603]

### Nets
GND: ACCEL.5(GND) ACCEL.10(GND) ACCEL.12(GND) C45.A ; also sheet 1,2,3,4,5,6,7,8,9,10,11,12,13,15
N$54: ACCEL.2(BYP) C45.C
SA0: ACCEL.7(SA0) R20.A
SCL1: ACCEL.4(SCL) ; also sheet 1,9
SDA1: ACCEL.6(SDA) ; also sheet 1,9
VREF3.3: ACCEL.1(VDDIO) ACCEL.14(VDD) R20.C ; also sheet 1,3,4,5,8,10,11,12,13,15
Unconnected: ACCEL.3(NC) ACCEL.8(NC) ACCEL.9(INT2) ACCEL.11(INT1) ACCEL.13(NC) ACCEL.15(NC) ACCEL.16(NC)

## Sheet 15 of 15: Wifi/BT
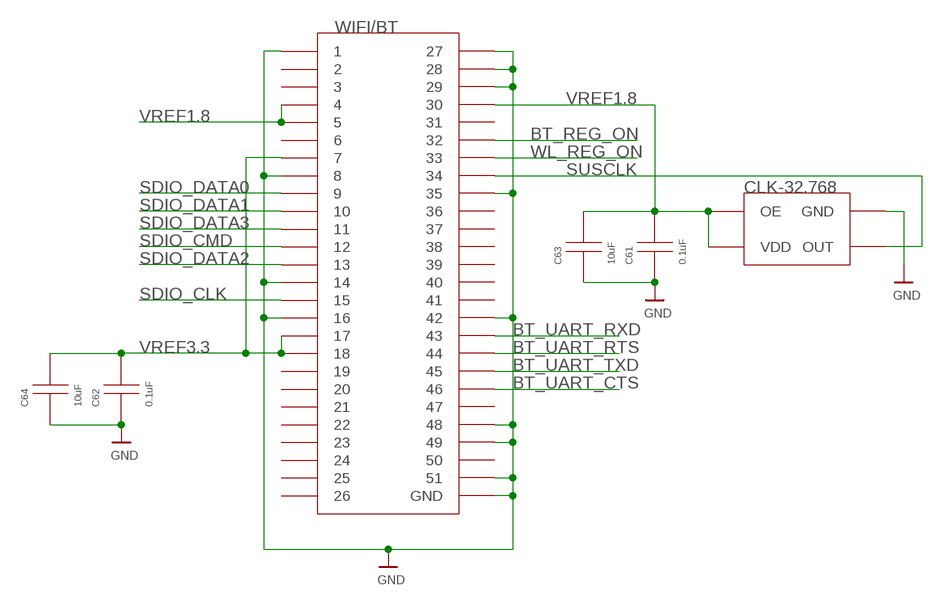
[diagram p14: schematic, sheet 15]

### Parts
C61  0.1uF  CAP-603  [CAP-603]
C62  0.1uF  CAP-603  [CAP-603]
C63  10uF  CAP-603  [CAP-603]
C64  10uF  CAP-603  [CAP-603]
CLK-32.768  CLK-ECS-327  [CLK-ECS-327]
WIFI/BT  IC-LWB5+  [IC-LWB5+]

### Nets
BT_REG_ON: WIFI/BT.32 ; also sheet 9
BT_UART_CTS: WIFI/BT.46 ; also sheet 9
BT_UART_RTS: WIFI/BT.44 ; also sheet 9
BT_UART_RXD: WIFI/BT.43 ; also sheet 9
BT_UART_TXD: WIFI/BT.45 ; also sheet 9
GND: C61.A C62.A C63.A C64.A CLK-32.768.GND WIFI/BT.1 WIFI/BT.8 WIFI/BT.14 WIFI/BT.16 WIFI/BT.27 WIFI/BT.28 WIFI/BT.29 WIFI/BT.35 WIFI/BT.42 WIFI/BT.48 WIFI/BT.49 WIFI/BT.51 WIFI/BT.G1(GND) WIFI/BT.G2(GND) WIFI/BT.G3(GND) WIFI/BT.G4(GND) WIFI/BT.G5(GND) WIFI/BT.G6(GND) WIFI/BT.G7(GND) WIFI/BT.G8(GND) WIFI/BT.G9(GND) WIFI/BT.G10(GND) WIFI/BT.G11(GND) WIFI/BT.G12(GND) WIFI/BT.G13(GND) WIFI/BT.G14(GND) WIFI/BT.G15(GND) WIFI/BT.G16(GND) WIFI/BT.G17(GND) ; also sheet 1,2,3,4,5,6,7,8,9,10,11,12,13,14
SDIO_CLK: WIFI/BT.15 ; also sheet 9
SDIO_CMD: WIFI/BT.12 ; also sheet 9
SDIO_DATA0: WIFI/BT.9 ; also sheet 9
SDIO_DATA1: WIFI/BT.10 ; also sheet 9
SDIO_DATA2: WIFI/BT.13 ; also sheet 9
SDIO_DATA3: WIFI/BT.11 ; also sheet 9
SUSCLK: CLK-32.768.OUT WIFI/BT.34
VREF1.8: C61.C C63.C CLK-32.768.OE CLK-32.768.VDD WIFI/BT.4 WIFI/BT.5 WIFI/BT.30 ; also sheet 3,5
VREF3.3: C62.C C64.C WIFI/BT.7 WIFI/BT.17 WIFI/BT.18 ; also sheet 1,3,4,5,8,10,11,12,13,14
WL_REG_ON: WIFI/BT.33 ; also sheet 9
Unconnected: WIFI/BT.2 WIFI/BT.3 WIFI/BT.6 WIFI/BT.19 WIFI/BT.20 WIFI/BT.21 WIFI/BT.22 WIFI/BT.23 WIFI/BT.24 WIFI/BT.25 WIFI/BT.26 WIFI/BT.31 WIFI/BT.36 WIFI/BT.37 WIFI/BT.38 WIFI/BT.39 WIFI/BT.40 WIFI/BT.41 WIFI/BT.47 WIFI/BT.50

## Library data of the parts
3.3V-1.8V_REG = Personal:IC-PAM2306
5V_REG = Personal:IC-TP61032
ACCEL = microbuilder:ACCEL_MMA845X: MMA845x 3-Axis ±2g/±4g/±8g Accelerometer
AUDIO_AMP = microbuilder:AUDIOAMP_MAX98306: MAX98306 3.7W Stereo Audio Amp - TDFN14 3.7W @ 3 ohm, 2.6-5.5V supply, 6-18dB selectable gain
AUDIO_DAC = microbuilder:AUDIO_I2S_UDA1334: UDA1334 I2C Audio DAC Power Supply: 2.4-3.6V Sample frequencies from 16-100kHz
BAT_CHR = Personal:IC-BQ25895
BAT_CONN = Personal:CONN-S2B-XH-A
BOARD_CONN_1 = Personal:MEZZANINE-AXT630124
BUF1-BUF3 = Personal:BUF-74LVC1G07
BUT_MISC BUT_PWR BUT_VOL_DOWN BUT_VOL_UP = Personal:BUT-KSS331GLFS
BUTL_CONN BUTR_CONN = Personal:CONN-FH52-10S-0.5SH
C1-C21 C24-C49 C51-C53 C56-C64 = Personal:CAP-603
C50 = Personal:CAP-TAN-1411
C54 C55 = microbuilder:CAP_ELECTROLYTIC: Electrolytic Capacitors SMT PANASONIC_C - Size C Panasonic Electrolytic Aluminum Capacitor 47µF 16V 20% Electrolytic Capacitor [Digikey: PCE3890TR-ND] PANASONIC_D - Size D Panasonic Electrolytic Aluminum Capacitor 100µF 25V 20% Electrolytic Capacitor [Digikey: PCE3898TR-ND] PTH 3.5 mm grid, 8 mm diameter ... 3.5 mm grid, 10 mm diameter ...
CLK-32.768 = Personal:CLK-ECS-327
CLK_24M = Personal:CLK-ECS-240
D1-D3 = Personal:DIODE-X3-WLB1608-2
FAN_CONN LCD_PWR_CONN = Personal:CONN-282834-2
FB1 FB2 = microbuilder:FERRITE: Ferrite Bead 0603 MMZ1608B121C - 120 Ohm @ 100MHz, 600mA, 0.15 Ohm DC Resistance - Digikey: 445-2164-1-ND BK1608HW121-T - 120 Ohm, 600mA Ferrite Chip - Digikey: 587-1876-2-ND 0805 HZ0805B272R-10 - 2.7K Ohm @ 100MHz, 200mA, 0.8 Ohm DC Resistance - Digikey: 240-2504-1-ND (see also Murata BLM21BD272SN1L) MMZ2012Y152B - 1.5K Ohm @ 100MHz, 500mA, 0.4 Ohm DC Resistance - Digikey: 445-1560-1-ND - Mainly for high frequency (80-400MHz) MMZ2012R102A - 1K Ohm @ 100MHz, 500mA, 0.3 Ohm DC Resistance - Digikey: 445-1555-2-ND - More general purpose (10-200MHz)
HDMI_CONN = Personal:HDMI-2001-1-2-21-00-BK
HDMI_CURLIM = Personal:CURLIM-AP2331
JOYL JOYR = Personal:CONN_5PIN
L1 = Personal:IND-74438357022
L2 = Personal:IND-NRS8040T6R8NJGJ
L3 L4 = Personal:IND-744043004
LCD_CONN = Personal:FPC-1-84952-5
LED1 LED2 = Personal:LED-SM0805UWC
LEVEL_ADJ = Personal:IC-TXB0104
MICROSD = Personal:MICROSD-5033981892_SD
MICROSD_SWI = Personal:IC-RT9742
MOT_CONN SPK_CONN = Personal:CONN-VS4B-ZR-SM4A-TF
R1-R20 R23-R51 = Personal:RES-603
RPI_BOOT_SW = Personal:DIP-A6TN-1104
RPI_PINS1-100 RPI_PINS101-200 = Personal:CONN-DF40_CL0594-5437-8-00_2D
T1 = Personal:THERM-NTCLE101E3C90173
TEENSY = Teensy_3_and_LC_Series_Boards_v1.4:TEENSY_LC_DIL
TEENSYUSB = Personal:CONN_4PIN
TP1-TP20 = Personal:TESTPOINT
TR1-TR6 = Personal:TRAN-DMG2302UKQ
USB_CURLIM = Personal:CURLIM-AP22653W6
USB_HUB = Personal:USBPORT-USB2514BT-I/M2
USB_IN = Personal:USB-USB3131-30-0230-A
USB_POE = Personal:POE_PROT-TPD4EUSB30DQAR
USB_PWR = Personal:USBC-USB-C31-S-RA-CS1D-BK-T/R
USB_SWI = Personal:USB_SWITCH-FSUSB42-D
WIFI/BT = Personal:IC-LWB5+

## Net classes
1 PWR 1A: width 0.254 mm
2 PWR 2A: width 0.762 mm
3 PWR 3A: width 1.27 mm
4 PWR 4A: width 2.032 mm